# EAGLE design ps (EAGLE 9.6.2)
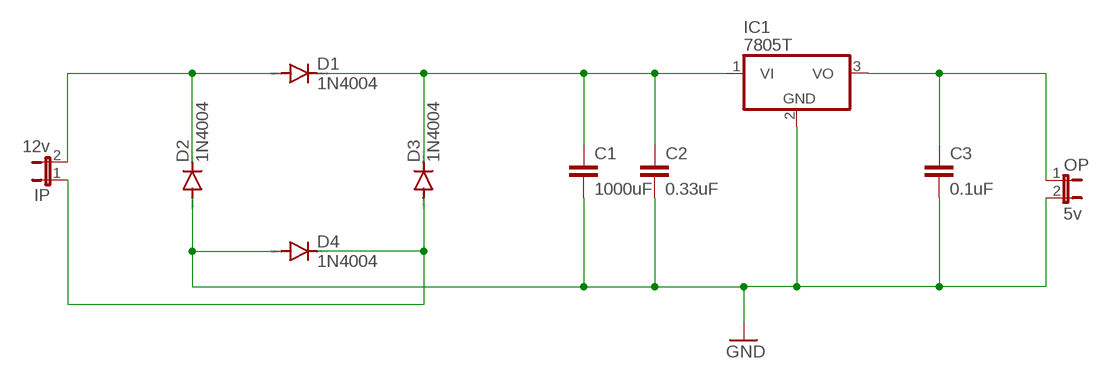
[diagram p0: schematic, sheet 1]

## Parts
C1  1000uF  C2,5-3  [C2.5-3]
C2  0.33uF  C2,5-3  [C2.5-3]
C3  0.1uF  C2,5-3  [C2.5-3]
D1  1N4004  [DO41-10]
D2  1N4004  [DO41-10]
D3  1N4004  [DO41-10]
D4  1N4004  [DO41-10]
IC1  7805T  [TO220H]
IP  12v  JP1E  [JP1]
OP  5v  JP1E  [JP1]

## Nets
GND: C1.2 C2.2 C3.2 D2.A D4.A IC1.2(GND) OP.2
N$1: D1.A D2.C IP.2
N$3: C1.1 C2.1 D1.C D3.C IC1.1(VI)
N$5: D3.A D4.C IP.1
N$6: C3.1 IC1.3(VO) OP.1

## Library data of the parts
C1-C3 = capacitor-wima:C: CAPACITOR naming: grid - package width
D1-D4 = diode:1N4004: DIODE general purpose rectifier, 1 A
IC1 = linear:78*: Positive VOLTAGE REGULATOR Source: http://cache.national.com/ds/LM/LM78L05.pdf http://www.fairchildsemi.com/ds/LM/LM7805.pdf
IP OP = jumper:JP1E: JUMPER

## Board
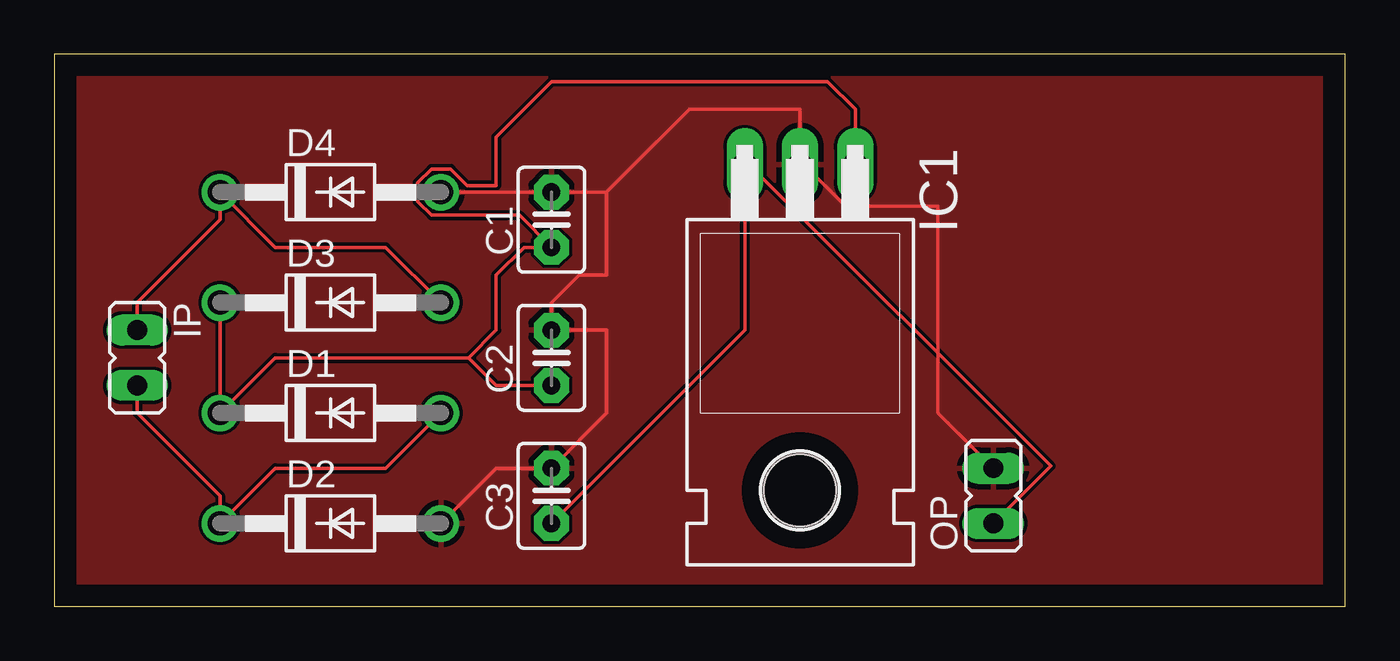
[diagram p1: board, top side]
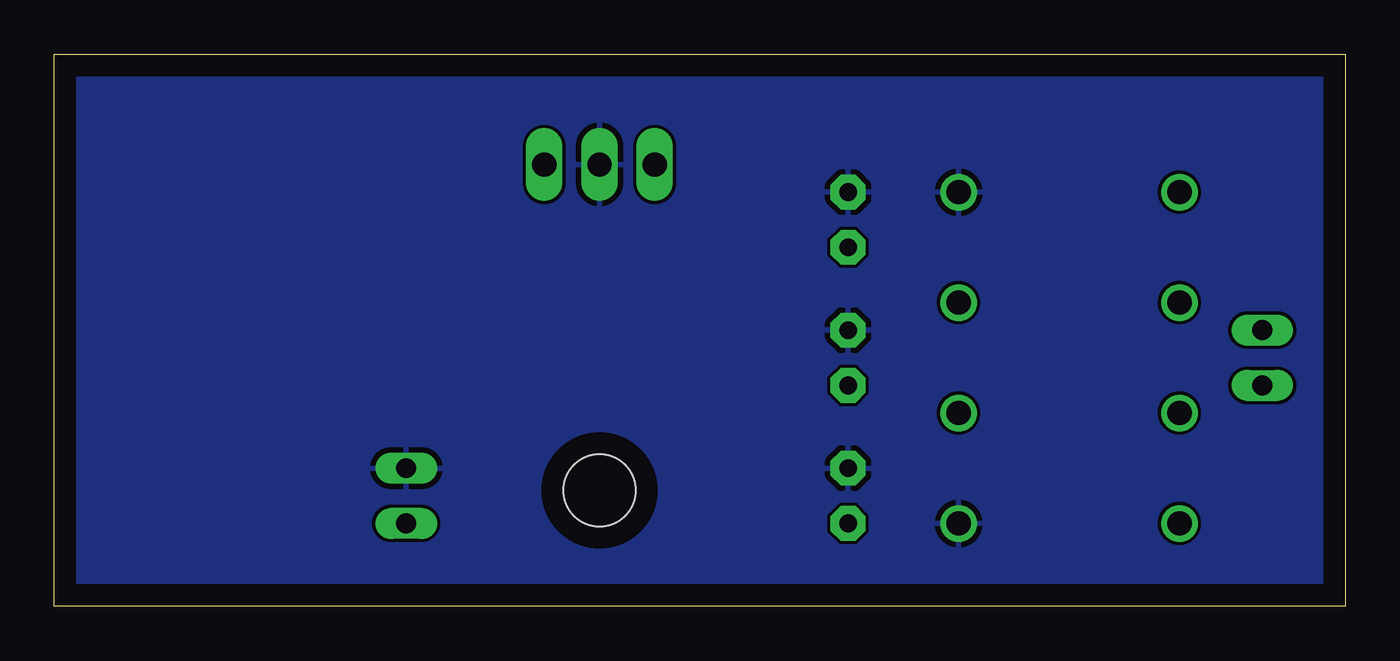
[diagram p2: board, bottom side, seen from below]

Size 59.36 x 25.39 mm. Coordinates in mm from the lower left corner, seen from the top.
Outline: 0,0 59.36,0 59.36,25.39 0,25.39 0,0
Copper layers (1*16): Top 0.035mm / dielectric 1.5mm / Bottom 0.035mm
Design rules "default": minimum track width 6mil, minimum drill 0.35mm, track to track 6mil, track to pad 6mil, pad to pad 6mil, via to via 6mil, smd to smd 6mil, copper to edge 40mil, drill to drill 6mil, minimum pad ring 10mil, minimum via ring 8mil, stop-mask expansion 4mil, vias tented up to drill 0mil, thermal gap 10mil

### Footprints (pad centres in the part's own frame; a part is rotated, then mirrored left to right if it is on the bottom)
C2.5-3 = drill 0.813 pad 1.6 octagon: 1 -1.27,0; 2 1.27,0
DO41-10 = drill 1.118: A 5.08,0; C -5.08,0
TO220H = drill 1.118 long: 1 -2.54,-10.16; 2 0,-10.16; 3 2.54,-10.16 | hole 3.302: 0,4.826
JP1 = drill 0.914 long: 1 0,-1.27; 2 0,1.27

### Placement (x,y rotation side)
C1  22.86,17.78 90 top
C2  22.86,11.43 90 top
C3  22.86,5.08 90 top
D1  12.7,8.89 0 top
D2  12.7,3.81 0 top
D3  12.7,13.97 0 top
D4  12.7,19.05 0 top
IC1  34.29,10.16 180 top
IP  3.81,11.43 180 top
OP  43.18,5.08 0 top

### Tracks (layer width: path | path; a pad name or v marks a point on that pad's centre or on a via)
GND
  Top 0.152: D4.A C1.2 25.4,19.05 | D2.A 20.32,6.35 C3.2 25.4,8.89 25.4,12.7 C2.2 22.86,13.97 24.13,15.24 25.4,15.24 25.4,19.05 | 25.4,19.05 29.21,22.86 34.29,22.86 IC1.2 34.48,20.32 36.39,18.41 40.64,18.41 40.64,8.89 OP.2
  pour Top: -1.27,26.67 60.96,26.67 60.96,-1.27 0,-1.27 -1.27,0
  pour Bottom: -2.54,27.94 62.23,27.94 62.23,-2.54 0,-2.54 -2.54,0
N$1
  Top 0.152: IP.2 3.81,8.89 7.62,5.08 D2.C 10.16,6.35 15.24,6.35 D1.A
N$3
  Top 0.152: D3.C D1.C 10.16,11.43 19.05,11.43 | 19.05,11.43 20.32,10.16 C2.1 | 19.05,11.43 20.32,12.7 20.32,15.24 21.59,16.51 C1.1 21.39,17.98 17.34,17.98 16.71,18.61 16.71,19.49 17.34,20.12 18.22,20.12 18.98,19.35 20.32,19.35 20.32,21.59 22.86,24.13 35.56,24.13 36.83,22.86 IC1.1
N$5
  Top 0.152: IP.1 3.81,13.97 7.62,17.78 D4.C 10.16,16.51 15.24,16.51 D3.A
N$6
  Top 0.152: C3.1 31.75,12.7 IC1.3 31.94,20.32 45.82,6.45 OP.1